# Altium project Temp Sensirion assy FPC.PrjPCB
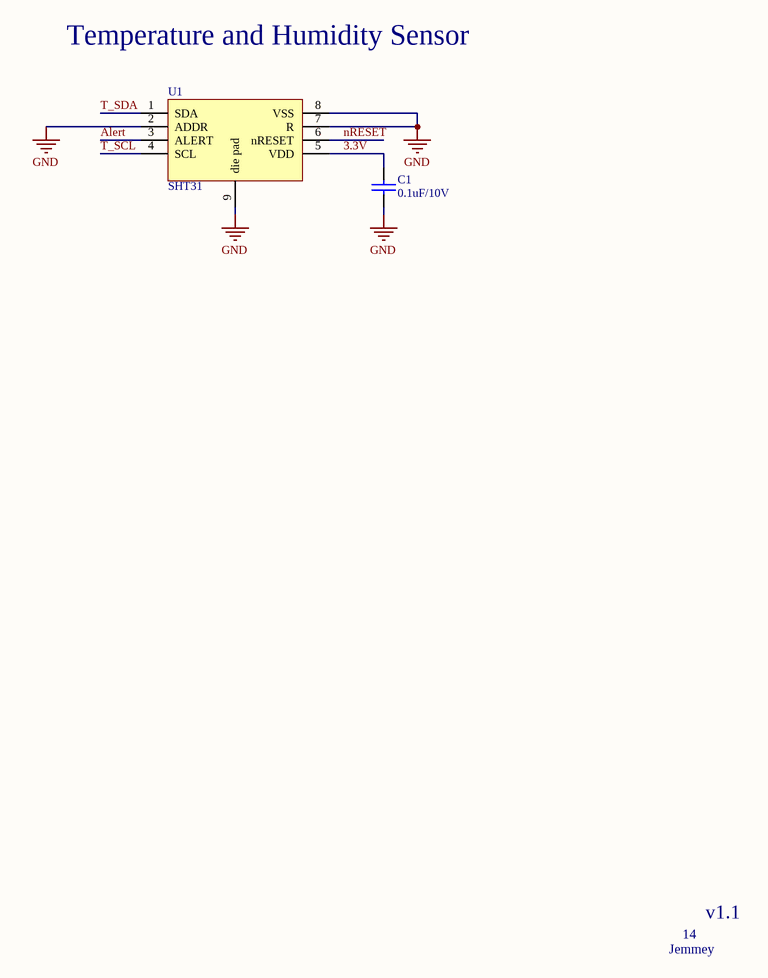
[diagram p0: Temp Sensirion assy FPC.SchDoc]
1 sheet, 2 parts. Net scope: global (net labels, ports and power ports of the same name join across sheets).
Board file: Temp Sensirion assy FPC.PcbDoc

## Sheet Temp Sensirion assy FPC.SchDoc
size A4

### Parts
C1  0.1uF/10V  [0402C]
U1  SHT31  [DFN]

### Nets
GND: C1.2 U1.2(ADDR) U1.7(R) U1.8(VSS) U1.9(die_pad)
3.3V: C1.1 U1.5(VDD)
Alert: U1.3(ALERT)
nRESET: U1.6(nRESET)
T_SCL: U1.4(SCL)
T_SDA: U1.1(SDA)

### Notes on the sheet
- Temperature and Humidity Sensor
- 14
- v1.1
- Jemmey

### Library data of the parts
C1 = CAP: 厂家：Murata，型号：GRM155R71A104KA01D
U1 = SHT31: 厂家：盛思睿，型号：SHT31